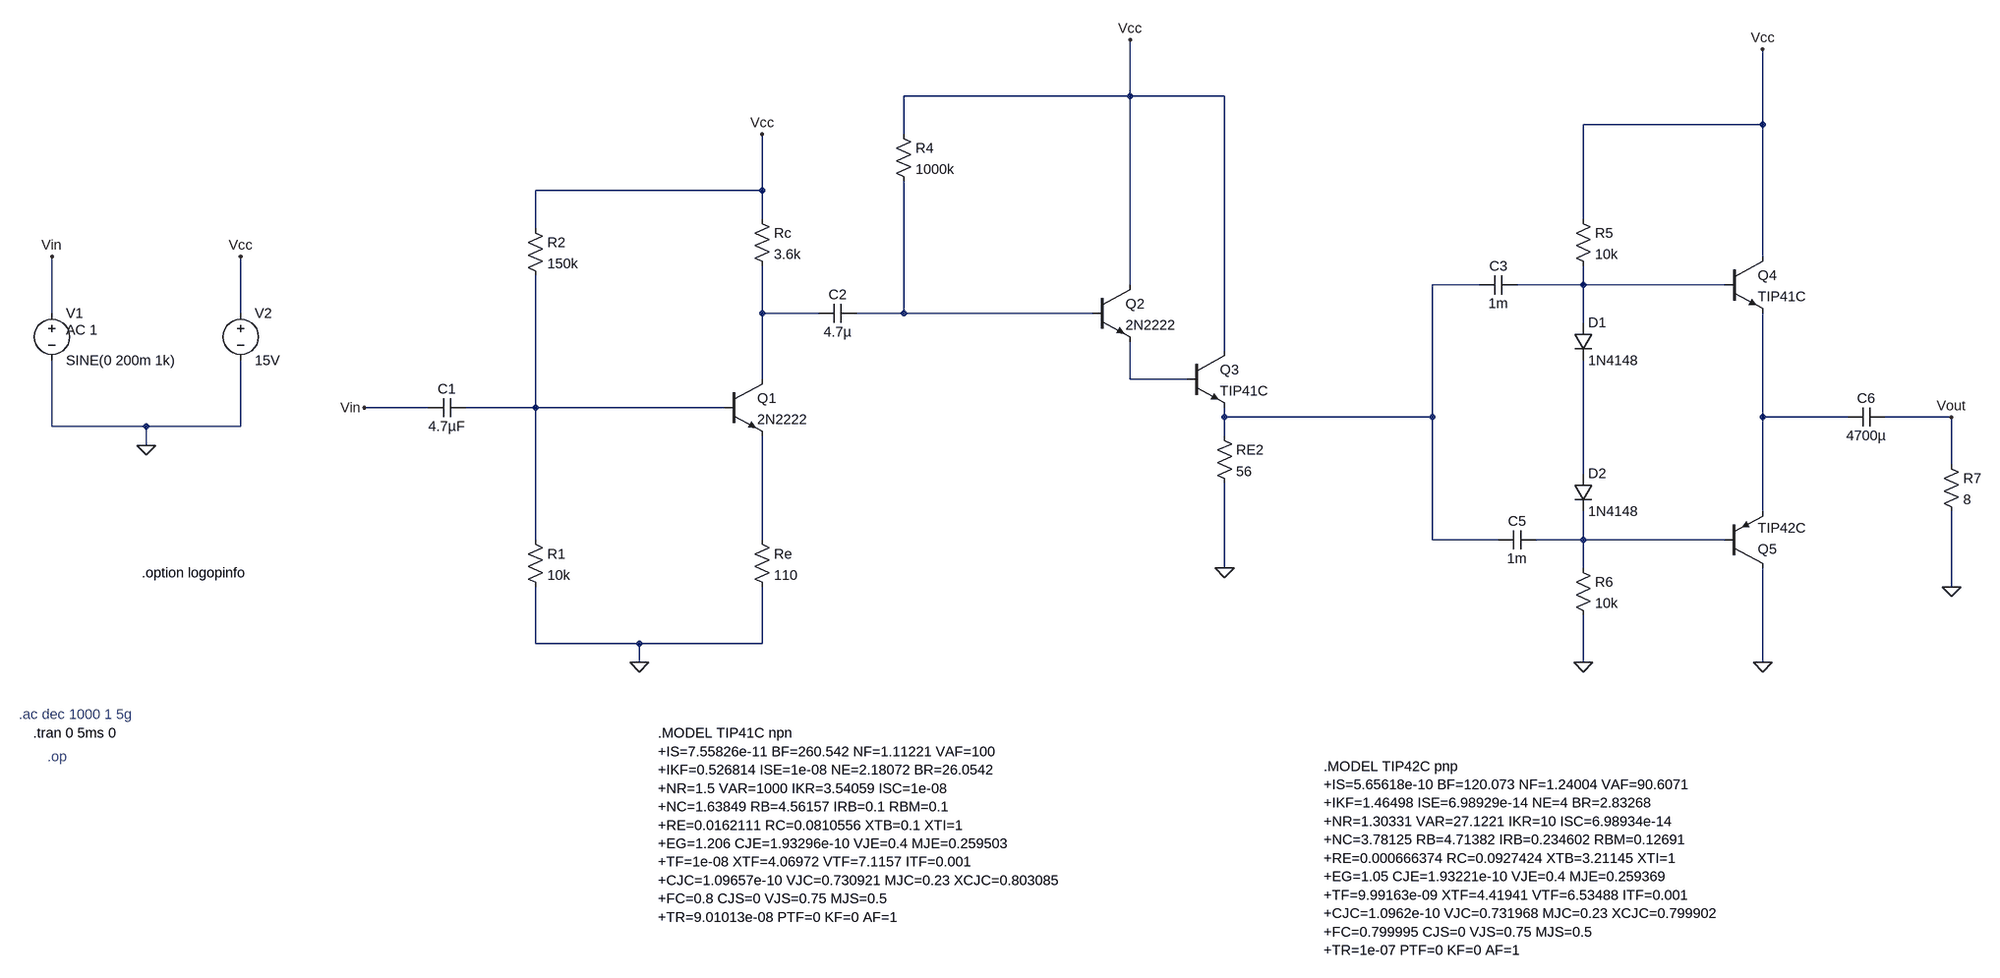
[diagram p0: schematic audio_amplifier_design.asc]
audio_amplifier_design.asc, the LTspice schematic file:
Version 4.1
SHEET 1 4076 968
WIRE 1440 -480 1440 -576
WIRE 1440 -480 1056 -480
WIRE 1600 -480 1440 -480
WIRE 2512 -432 2512 -560
WIRE 2512 -432 2208 -432
WIRE 1056 -416 1056 -480
WIRE 816 -320 816 -416
WIRE 816 -320 432 -320
WIRE 816 -272 816 -320
WIRE 2208 -272 2208 -432
WIRE 432 -256 432 -320
WIRE 2512 -208 2512 -432
WIRE 1440 -160 1440 -480
WIRE 2032 -160 1952 -160
WIRE 2208 -160 2208 -192
WIRE 2208 -160 2096 -160
WIRE 2448 -160 2208 -160
WIRE -496 -112 -496 -208
WIRE -176 -112 -176 -208
WIRE 816 -112 816 -192
WIRE 912 -112 816 -112
WIRE 1056 -112 1056 -336
WIRE 1056 -112 976 -112
WIRE 1376 -112 1056 -112
WIRE 2208 -96 2208 -160
WIRE 1600 -48 1600 -480
WIRE 816 0 816 -112
WIRE 1440 0 1440 -64
WIRE 1536 0 1440 0
WIRE 240 48 80 48
WIRE 432 48 432 -176
WIRE 432 48 304 48
WIRE 752 48 432 48
WIRE 1600 64 1600 48
WIRE 1952 64 1952 -160
WIRE 1952 64 1600 64
WIRE 2512 64 2512 -112
WIRE 2656 64 2512 64
WIRE 2832 64 2720 64
WIRE -496 80 -496 -32
WIRE -336 80 -496 80
WIRE -176 80 -176 -32
WIRE -176 80 -336 80
WIRE 1600 96 1600 64
WIRE -336 112 -336 80
WIRE 2832 144 2832 64
WIRE 2208 160 2208 -32
WIRE 2512 224 2512 64
WIRE 432 272 432 48
WIRE 816 272 816 96
WIRE 1952 272 1952 64
WIRE 2064 272 1952 272
WIRE 2208 272 2208 224
WIRE 2208 272 2128 272
WIRE 2448 272 2208 272
WIRE 1600 320 1600 176
WIRE 2208 320 2208 272
WIRE 2832 352 2832 224
WIRE 432 448 432 352
WIRE 608 448 432 448
WIRE 816 448 816 352
WIRE 816 448 608 448
WIRE 608 480 608 448
WIRE 2208 480 2208 400
WIRE 2512 480 2512 320
FLAG -336 112 0
FLAG -496 -208 Vin
FLAG -176 -208 Vcc
FLAG 80 48 Vin
FLAG 816 -416 Vcc
FLAG 608 480 0
FLAG 1440 -576 Vcc
FLAG 1600 320 0
FLAG 2832 64 Vout
FLAG 2832 352 0
FLAG 2208 480 0
FLAG 2512 480 0
FLAG 2512 -560 Vcc
SYMBOL voltage -496 -128 R0
WINDOW 123 24 44 Left 2
WINDOW 39 0 0 Left 0
SYMATTR Value2 AC 1
SYMATTR InstName V1
SYMATTR Value SINE(0 200m 1k)
SYMBOL voltage -176 -128 R0
SYMATTR InstName V2
SYMATTR Value 15V
SYMBOL res 416 256 R0
SYMATTR InstName R1
SYMATTR Value 10k
SYMBOL res 416 -272 R0
SYMATTR InstName R2
SYMATTR Value 150k
SYMBOL res 800 -288 R0
SYMATTR InstName Rc
SYMATTR Value 3.6k
SYMBOL res 800 256 R0
SYMATTR InstName Re
SYMATTR Value 110
SYMBOL cap 304 32 R90
WINDOW 0 0 32 VBottom 2
WINDOW 3 32 32 VTop 2
SYMATTR InstName C1
SYMATTR Value 4.7µF
SYMBOL npn 752 0 R0
SYMATTR InstName Q1
SYMATTR Value 2N2222
SYMBOL npn 1376 -160 R0
SYMATTR InstName Q2
SYMATTR Value 2N2222
SYMBOL res 1040 -432 R0
SYMATTR InstName R4
SYMATTR Value 1000k
SYMBOL res 1584 80 R0
SYMATTR InstName RE2
SYMATTR Value 56
SYMBOL cap 2032 -144 R270
WINDOW 0 32 32 VTop 2
WINDOW 3 0 32 VBottom 2
SYMATTR InstName C3
SYMATTR Value 1m
SYMBOL diode 2192 -96 R0
SYMATTR InstName D1
SYMATTR Value 1N4148
SYMBOL diode 2192 160 R0
SYMATTR InstName D2
SYMATTR Value 1N4148
SYMBOL pnp 2448 320 M180
SYMATTR InstName Q5
SYMATTR Value TIP42C
SYMBOL npn 2448 -208 R0
SYMATTR InstName Q4
SYMATTR Value TIP41C
SYMBOL res 2192 -288 R0
SYMATTR InstName R5
SYMATTR Value 10k
SYMBOL res 2192 304 R0
SYMATTR InstName R6
SYMATTR Value 10k
SYMBOL cap 2720 48 R90
WINDOW 0 0 32 VBottom 2
WINDOW 3 32 32 VTop 2
SYMATTR InstName C6
SYMATTR Value 4700µ
SYMBOL res 2816 128 R0
SYMATTR InstName R7
SYMATTR Value 8
SYMBOL cap 2064 288 R270
WINDOW 0 32 32 VTop 2
WINDOW 3 0 32 VBottom 2
SYMATTR InstName C5
SYMATTR Value 1m
SYMBOL npn 1536 -48 R0
SYMATTR InstName Q3
SYMATTR Value TIP41C
SYMBOL cap 976 -128 R90
WINDOW 0 0 32 VBottom 2
WINDOW 3 32 32 VTop 2
SYMATTR InstName C2
SYMATTR Value 4.7µ
TEXT -528 600 Left 2 !.tran 0 5ms 0
TEXT -504 640 Left 2 ;.op
TEXT 640 600 Left 2 !.MODEL TIP41C npn\n+IS=7.55826e-11 BF=260.542 NF=1.11221 VAF=100\n+IKF=0.526814 ISE=1e-08 NE=2.18072 BR=26.0542\n+NR=1.5 VAR=1000 IKR=3.54059 ISC=1e-08\n+NC=1.63849 RB=4.56157 IRB=0.1 RBM=0.1\n+RE=0.0162111 RC=0.0810556 XTB=0.1 XTI=1\n+EG=1.206 CJE=1.93296e-10 VJE=0.4 MJE=0.259503\n+TF=1e-08 XTF=4.06972 VTF=7.1157 ITF=0.001\n+CJC=1.09657e-10 VJC=0.730921 MJC=0.23 XCJC=0.803085\n+FC=0.8 CJS=0 VJS=0.75 MJS=0.5\n+TR=9.01013e-08 PTF=0 KF=0 AF=1
TEXT 1768 656 Left 2 !.MODEL TIP42C pnp\n+IS=5.65618e-10 BF=120.073 NF=1.24004 VAF=90.6071\n+IKF=1.46498 ISE=6.98929e-14 NE=4 BR=2.83268\n+NR=1.30331 VAR=27.1221 IKR=10 ISC=6.98934e-14\n+NC=3.78125 RB=4.71382 IRB=0.234602 RBM=0.12691\n+RE=0.000666374 RC=0.0927424 XTB=3.21145 XTI=1\n+EG=1.05 CJE=1.93221e-10 VJE=0.4 MJE=0.259369\n+TF=9.99163e-09 XTF=4.41941 VTF=6.53488 ITF=0.001\n+CJC=1.0962e-10 VJC=0.731968 MJC=0.23 XCJC=0.799902\n+FC=0.799995 CJS=0 VJS=0.75 MJS=0.5\n+TR=1e-07 PTF=0 KF=0 AF=1
TEXT -552 568 Left 2 ;.ac dec 1000 1 5g
TEXT -344 328 Left 2 !.option logopinfo

The netlist it stands for:
* audio_amplifier_design.asc
V1 Vin 0 SINE(0 200m 1k) AC 1
V2 Vcc 0 15V
R1 N006 0 10k
R2 Vcc N006 150k
Rc Vcc N003 3.6k
Re N009 0 110
C1 N006 Vin 4.7µF
Q1 N003 N006 N009 0 2N2222
Q2 Vcc N004 N005 0 2N2222
R4 Vcc N004 1000k
RE2 N001 0 56
C3 N001 N002 1m
D1 N002 N008 1N4148
D2 N008 N010 1N4148
Q5 0 N010 N007 0 TIP42C
Q4 Vcc N002 N007 0 TIP41C
R5 Vcc N002 10k
R6 N010 0 10k
C6 Vout N007 4700µ
R7 Vout 0 8
C5 N001 N010 1m
Q3 Vcc N005 N001 0 TIP41C
C2 N004 N003 4.7µ
.model D D
.lib standard.dio
.model NPN NPN
.model PNP PNP
.lib standard.bjt
.tran 0 5ms 0
* .op
.MODEL TIP41C npn
+IS=7.55826e-11 BF=260.542 NF=1.11221 VAF=100
+IKF=0.526814 ISE=1e-08 NE=2.18072 BR=26.0542
+NR=1.5 VAR=1000 IKR=3.54059 ISC=1e-08
+NC=1.63849 RB=4.56157 IRB=0.1 RBM=0.1
+RE=0.0162111 RC=0.0810556 XTB=0.1 XTI=1
+EG=1.206 CJE=1.93296e-10 VJE=0.4 MJE=0.259503
+TF=1e-08 XTF=4.06972 VTF=7.1157 ITF=0.001
+CJC=1.09657e-10 VJC=0.730921 MJC=0.23 XCJC=0.803085
+FC=0.8 CJS=0 VJS=0.75 MJS=0.5
+TR=9.01013e-08 PTF=0 KF=0 AF=1
.MODEL TIP42C pnp
+IS=5.65618e-10 BF=120.073 NF=1.24004 VAF=90.6071
+IKF=1.46498 ISE=6.98929e-14 NE=4 BR=2.83268
+NR=1.30331 VAR=27.1221 IKR=10 ISC=6.98934e-14
+NC=3.78125 RB=4.71382 IRB=0.234602 RBM=0.12691
+RE=0.000666374 RC=0.0927424 XTB=3.21145 XTI=1
+EG=1.05 CJE=1.93221e-10 VJE=0.4 MJE=0.259369
+TF=9.99163e-09 XTF=4.41941 VTF=6.53488 ITF=0.001
+CJC=1.0962e-10 VJC=0.731968 MJC=0.23 XCJC=0.799902
+FC=0.799995 CJS=0 VJS=0.75 MJS=0.5
+TR=1e-07 PTF=0 KF=0 AF=1
* .ac dec 1000 1 5g
.option logopinfo
.backanno
.end